# EAGLE design 16bit-v0_2 (EAGLE 7.2.0)
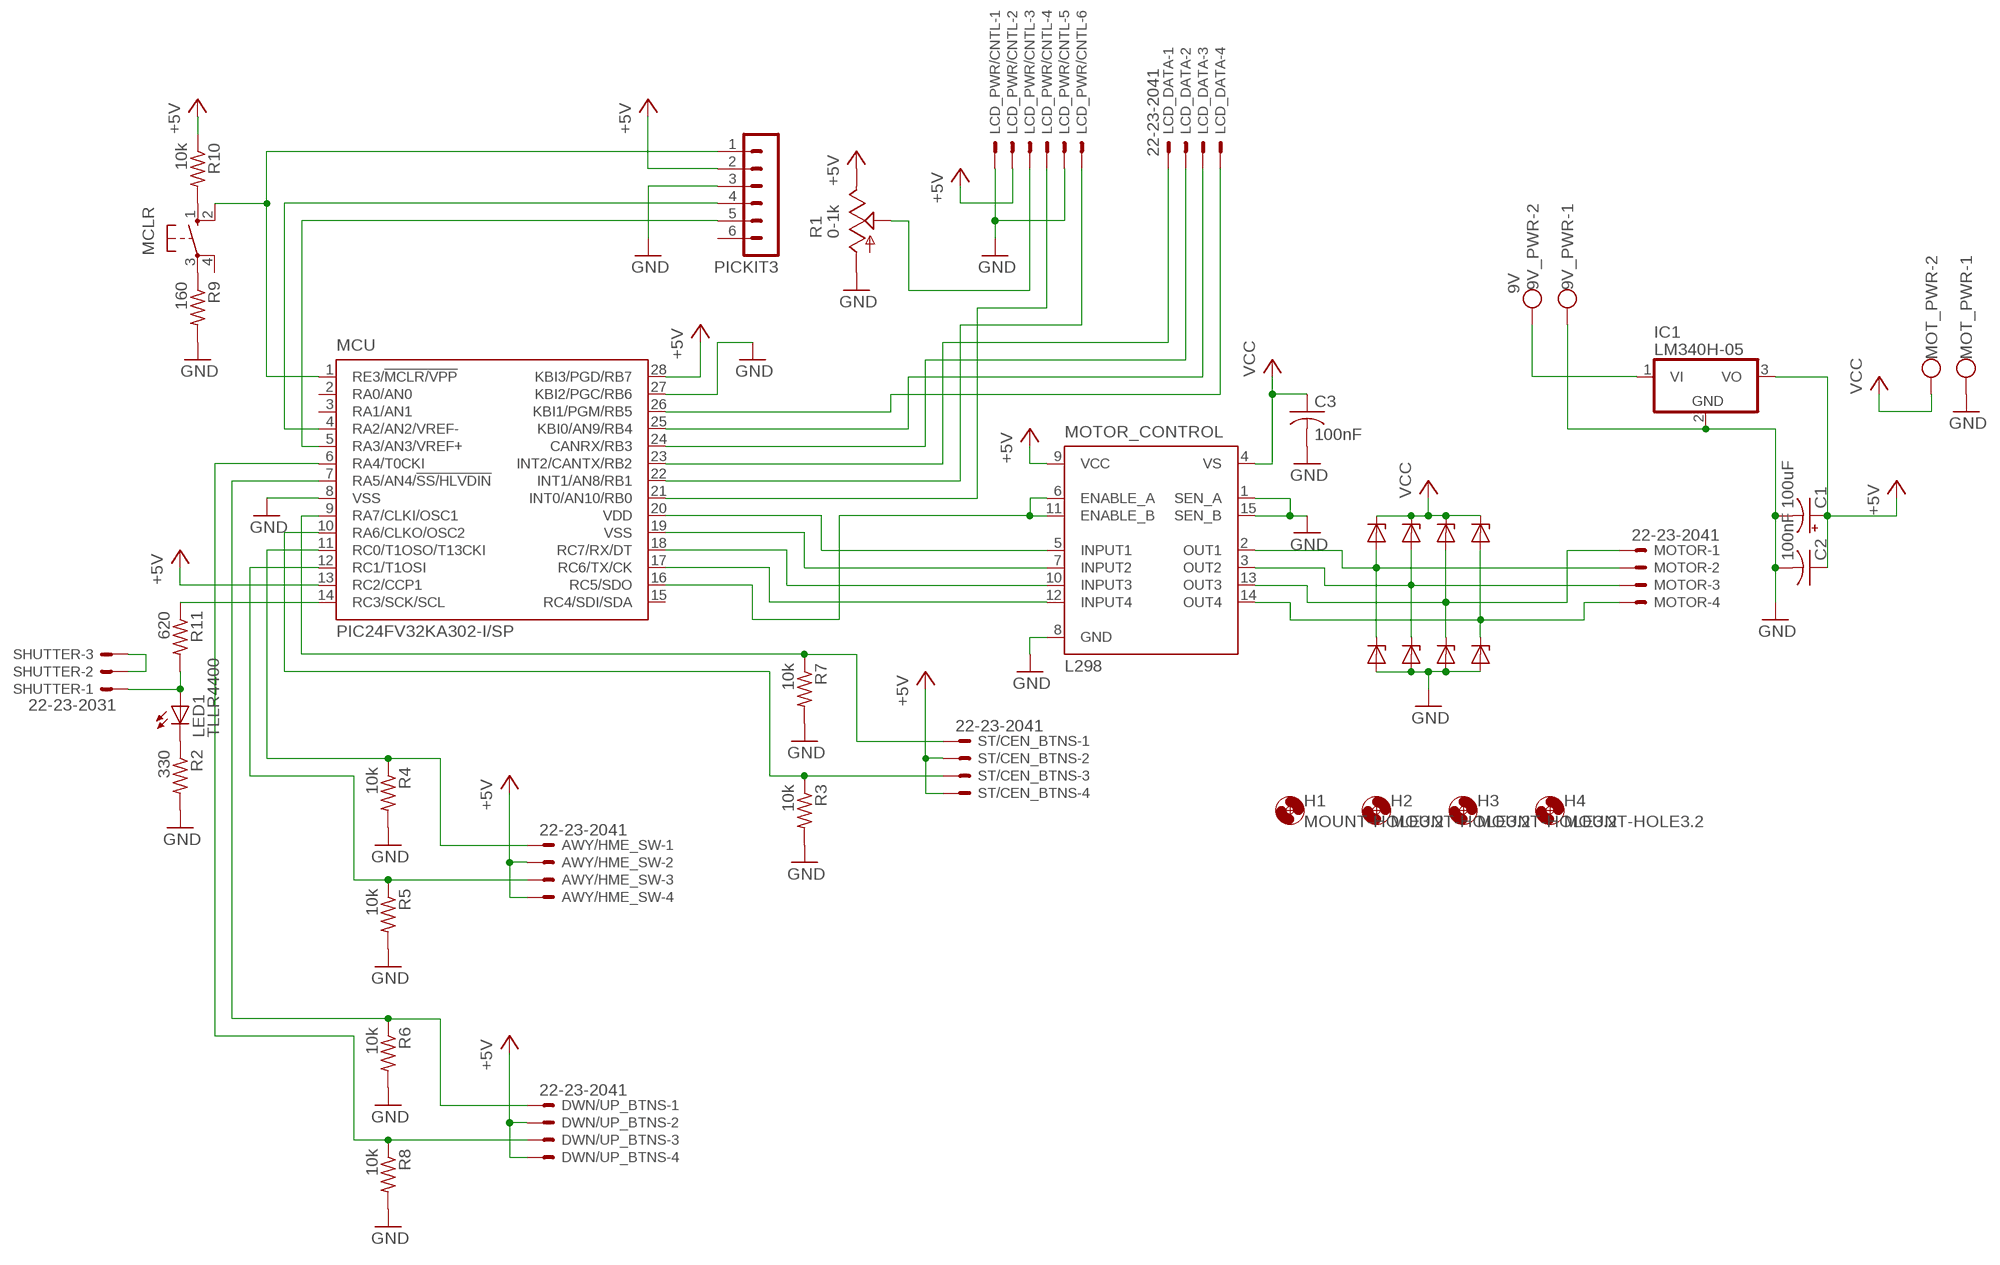
[diagram p0: schematic, sheet 1]

## Parts
9V_PWR  9V  W237-102  [W237-102]
AWY/HME_SW  22-23-2041  [22-23-2041]
C1  100uF  CPOL-USE2.5-7  [E2,5-7]
C2  100nF  C-US025-025X050  [C025-025X050]
C3  100nF  C-US025-025X050  [C025-025X050]
D1  BZX90  [DO34Z7]
D2  BZX90  [DO34Z7]
D3  BZX90  [DO34Z7]
D4  BZX90  [DO34Z7]
D5  BZX90  [DO34Z7]
D6  BZX90  [DO34Z7]
D7  BZX90  [DO34Z7]
D8  BZX90  [DO34Z7]
DWN/UP_BTNS  22-23-2041  [22-23-2041]
H1  MOUNT-HOLE3.2  [3,2]
H2  MOUNT-HOLE3.2  [3,2]
H3  MOUNT-HOLE3.2  [3,2]
H4  MOUNT-HOLE3.2  [3,2]
IC1  LM340H-05  [TO220H]
LCD_DATA  22-23-2041  [22-23-2041]
LCD_PWR/CNTL  22-23-2061  [22-23-2061]
LED1  TLLR4400  [LED3MM]
MCLR  10-XX  [B3F-10XX]
MCU  PIC18F2580-I/SP  [DIL28-3]
MOT_PWR  W237-102  [W237-102]
MOTOR  22-23-2041  [22-23-2041]
MOTOR_CONTROL  L298  [MULTIWATT-15]
PICKIT3  MA06-1  [MA06-1]
R1  0-1k  TRIM_US-B25P  [B25P]
R2  330  R-US_0207/7  [0207/7]
R3  10k  R-US_0207/7  [0207/7]
R4  10k  R-US_0207/7  [0207/7]
R5  10k  R-US_0207/7  [0207/7]
R6  10k  R-US_0207/7  [0207/7]
R7  10k  R-US_0207/7  [0207/7]
R8  10k  R-US_0207/7  [0207/7]
R9  160  R-US_0207/7  [0207/7]
R10  10k  R-US_0207/7  [0207/7]
R11  620  R-US_0207/7  [0207/7]
SHUTTER  22-23-2031  [22-23-2031]
ST/CEN_BTNS  22-23-2041  [22-23-2041]

## Nets
+5V: AWY/HME_SW.2 AWY/HME_SW.4 C1.+ C2.1 DWN/UP_BTNS.2 DWN/UP_BTNS.4 IC1.3(VO) LCD_PWR/CNTL.2 MCU.13(RC2/CCP1) MCU.28(KBI3/PGD/RB7) MOTOR_CONTROL.9(VCC) PICKIT3.2 R1.E R10.1 ST/CEN_BTNS.2 ST/CEN_BTNS.4
GND: 9V_PWR.1 C1.- C2.2 C3.2 D5.A D6.A D7.A D8.A IC1.2(GND) LCD_PWR/CNTL.1 LCD_PWR/CNTL.5 MCU.8(VSS) MCU.27(KBI2/PGC/RB6) MOT_PWR.1 MOTOR_CONTROL.8(GND) PICKIT3.3 R1.A R2.2 R3.2 R4.2 R5.2 R6.2 R7.2 R8.2 R9.2
N$1: MCLR.2(S1) MCU.1(RE3/!MCLR/VPP) PICKIT3.1
N$2: MCU.5(RA3/AN3/VREF+) PICKIT3.5
N$3: MCU.4(RA2/AN2/VREF-) PICKIT3.4
N$4: LED1.K(C) R2.1
N$5: MOTOR_CONTROL.1(SEN_A) MOTOR_CONTROL.15(SEN_B) ; supply symbol labelled GND
N$6: MCU.14(RC3/SCK/SCL) R11.1
N$7: MCU.16(RC5/SDO) MOTOR_CONTROL.6(ENABLE_A) MOTOR_CONTROL.11(ENABLE_B)
N$8: LCD_PWR/CNTL.3 R1.S
N$9: LCD_PWR/CNTL.4 MCU.21(INT0/AN10/RB0)
N$10: LCD_PWR/CNTL.6 MCU.22(INT1/AN8/RB1)
N$11: LCD_DATA.2 MCU.24(CANRX/RB3)
N$12: LCD_DATA.3 MCU.25(KBI0/AN9/RB4)
N$13: LCD_DATA.4 MCU.26(KBI1/PGM/RB5)
N$14: MCU.17(RC6/TX/CK) MOTOR_CONTROL.12(INPUT4)
N$15: AWY/HME_SW.1 MCU.11(RC0/T1OSO/T13CKI) R4.1
N$16: D2.A D6.C MOTOR.3 MOTOR_CONTROL.3(OUT2)
N$17: D3.A D7.C MOTOR.1 MOTOR_CONTROL.13(OUT3)
N$18: D4.A D8.C MOTOR.4 MOTOR_CONTROL.14(OUT4)
N$19: LED1.A R11.2 SHUTTER.1
N$20: LCD_DATA.1 MCU.23(INT2/CANTX/RB2)
N$21: MCU.10(RA6/CLKO/OSC2) R3.1 ST/CEN_BTNS.3
N$22: MCU.18(RC7/RX/DT) MOTOR_CONTROL.10(INPUT3)
N$23: DWN/UP_BTNS.1 MCU.7(RA5/AN4/!SS/HLVDIN) R6.1
N$24: MCU.9(RA7/CLKI/OSC1) R7.1 ST/CEN_BTNS.1
N$25: DWN/UP_BTNS.3 MCU.6(RA4/T0CKI) R8.1
N$26: MCU.19(VSS) MOTOR_CONTROL.7(INPUT2)
N$27: AWY/HME_SW.3 MCU.12(RC1/T1OSI) R5.1
N$28: D1.A D5.C MOTOR.2 MOTOR_CONTROL.2(OUT1)
N$31: MCU.20(VDD) MOTOR_CONTROL.5(INPUT1)
N$35: MCLR.1(S) R10.2
N$36: SHUTTER.2 SHUTTER.3
N$38: MCLR.3(P) R9.1
N$40: 9V_PWR.2 IC1.1(VI)
VCC: C3.1 D1.C D2.C D3.C D4.C MOT_PWR.2 MOTOR_CONTROL.4(VS)
Unconnected: MCLR.4(P1) MCU.2(RA0/AN0) MCU.3(RA1/AN1) MCU.15(RC4/SDI/SDA) PICKIT3.6

## Library data of the parts
9V_PWR MOT_PWR = con-wago-500:W237-102: WAGO SCREW CLAMP; MPN: 237-102; OC_FARNELL: unknown; OC_NEWARK: 70K9898
AWY/HME_SW DWN/UP_BTNS LCD_DATA MOTOR ST/CEN_BTNS = con-molex:22-23-2041: .100" (2.54mm) Center Header - 4 Pin; MF: MOLEX; MPN: 22-23-2041; OC_FARNELL: 1462920; OC_NEWARK: 38C0355
C1 = rcl:CPOL-US: POLARIZED CAPACITOR, American symbol
C2 C3 = rcl:C-US: CAPACITOR, American symbol
D1-D8 = diode:BZX90: Z DIODE
H1-H4 = holes:MOUNT-HOLE: MOUNTING HOLE with drill center marker
IC1 = linear:LM340?-*: Positive VOLTAGE REGULATOR Source: http://cache.national.com/ds/LM/LM340.pdf
LCD_PWR/CNTL = con-molex:22-23-2061: .100" (2.54mm) Center Header - 6 Pin; MF: MOLEX; MPN: 22-23-2061; OC_FARNELL: 1462922; OC_NEWARK: 27C1933
LED1 = led:TLLR4400: Low Current (2mA) LED 3 mm Tinted Diffused Package color RED Source: Data sheet <http://www.farnell.com/datasheets/391100.pdf>; MF: VISHAY SEMICONDUCTOR; OC_FARNELL: 1612437
MCLR = switch-omron:10-XX: OMRON SWITCH; MPN: B3F-1000; OC_FARNELL: 176432; OC_NEWARK: 36M3542
MCU = microchip:PIC18F2*80: 28-Pin Enhanced Flash Microcontrollers with ECAN(TM) Technology 10-Bit A/D and nanoWatt Technology Source: http://www.microchip.com .. 39637a.pdf; MF: MICROCHIP; MPN: PIC24FV32KA302-I/SP; OC_FARNELL: 9321276; OC_NEWARK: 71J7244
MOTOR_CONTROL = st-microelectronics:L298: DUAL FULL-BRIDGE DRIVER; MPN: L298N; OC_FARNELL: 1589425; OC_NEWARK: 32M1527
PICKIT3 = con-lstb:MA06-1: PIN HEADER; OC_FARNELL: unknown; OC_NEWARK: unknown
R1 = pot:TRIM_US-: POTENTIOMETER
R2-R11 = resistor:R-US_: RESISTOR, American symbol
SHUTTER = con-molex:22-23-2031: .100" (2.54mm) Center Header - 3 Pin; MF: MOLEX; MPN: 22-23-2031; OC_FARNELL: 1462950; OC_NEWARK: 30C0862

## Board
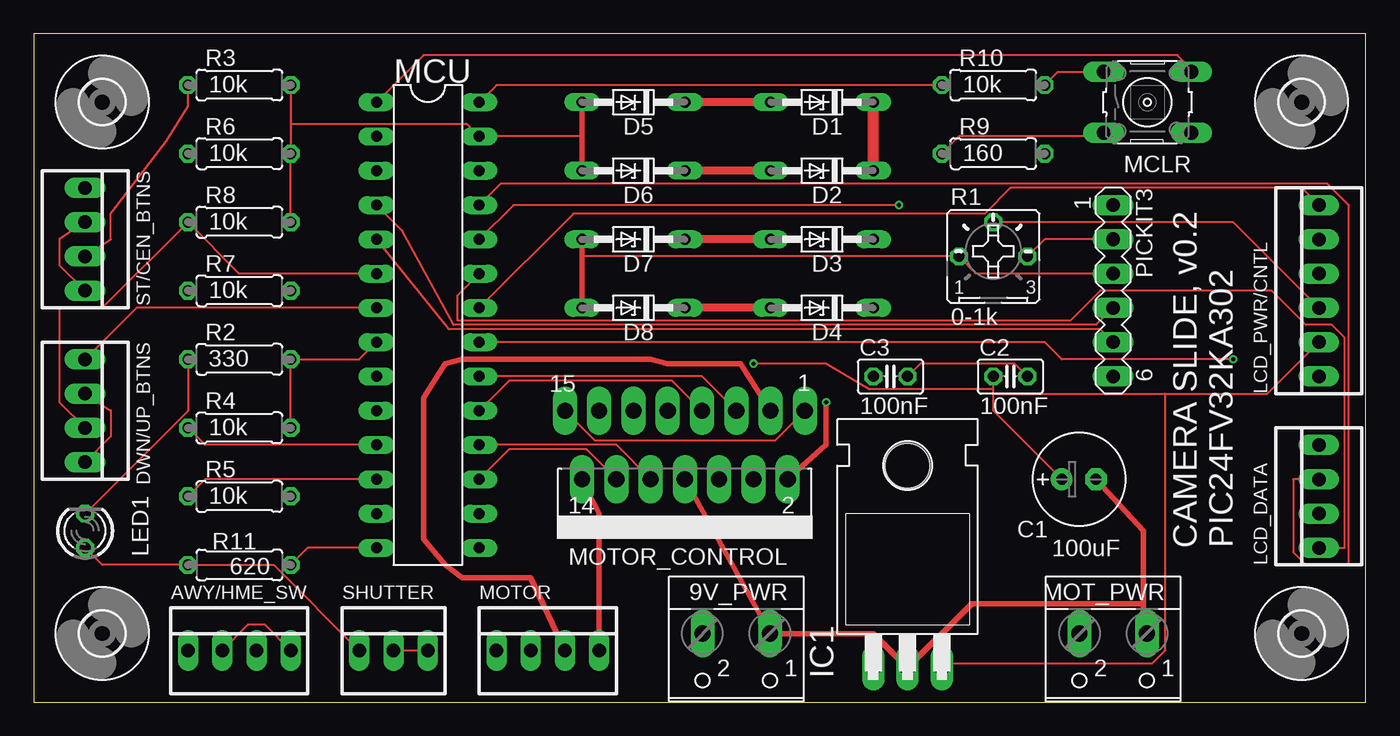
[diagram p1: board, top side]
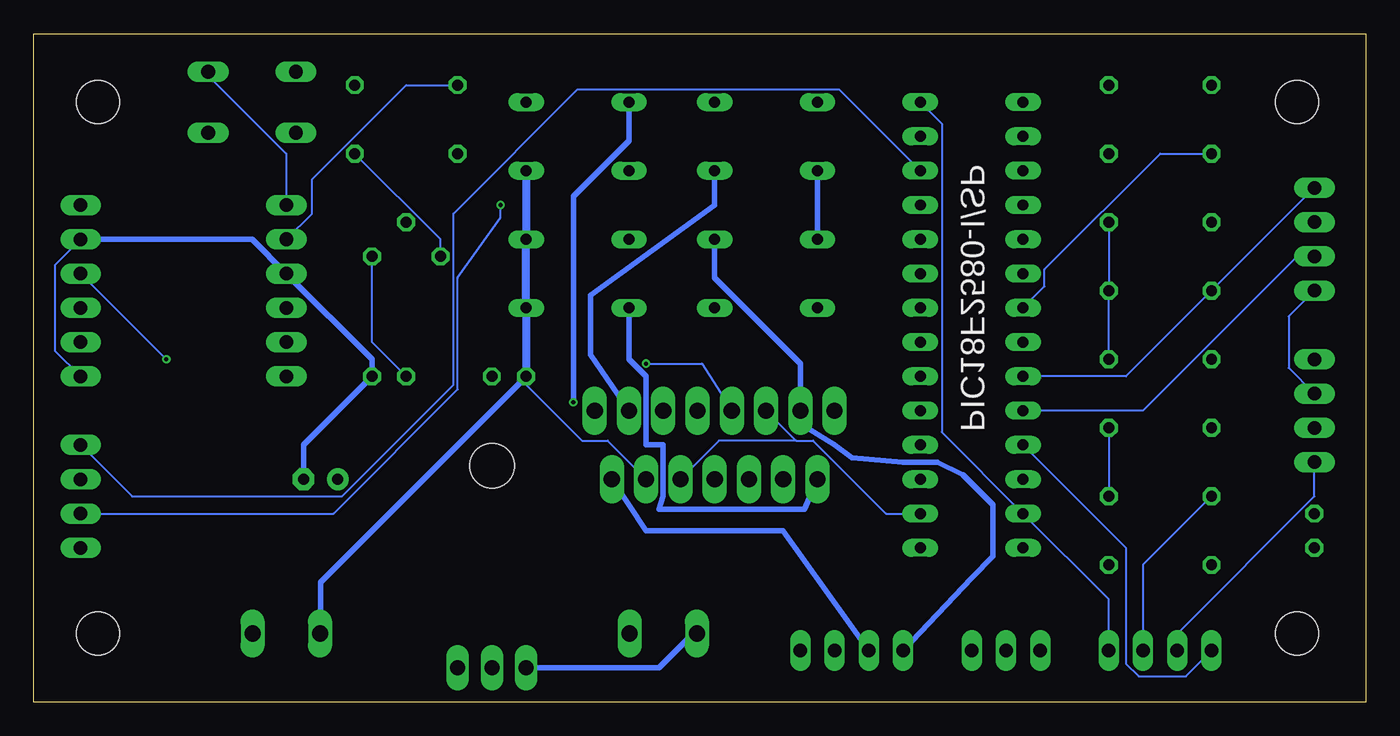
[diagram p2: board, bottom side, seen from below]

Size 98.73 x 49.52 mm. Coordinates in mm from the lower left corner, seen from the top.
Outline: 0,0 98.73,0 98.73,49.52 0,49.52 0,0
Copper layers (1*16): Top 0.035mm / dielectric 1.5mm / Bottom 0.035mm
Design rules "ITEADstudio_DRC": minimum track width 6mil, minimum drill 12mil, track to track 6mil, track to pad 6mil, pad to pad 6mil, via to via 6mil, smd to smd 0mil, copper to edge 10mil, drill to drill 10mil, minimum pad ring 10mil, minimum via ring 6mil, stop-mask expansion 2mil, vias tented up to drill 100mil, thermal gap 10mil

### Footprints (pad centres in the part's own frame; a part is rotated, then mirrored left to right if it is on the bottom)
W237-102 = drill 1.194 long: 1 -2.5,-1.27; 2 2.5,-1.27
22-23-2041 = drill 1 long: 1 -3.81,0; 2 -1.27,0; 3 1.27,0; 4 3.81,0
E2,5-7 = drill 0.813 pad 1.6: + -1.27,0 | drill 0.813 pad 1.6 octagon: - 1.27,0
C025-025X050 = drill 0.813 octagon: 1 -1.27,0; 2 1.27,0
DO34Z7 = drill 0.813 long: A 3.81,0; C -3.81,0
3,2 = hole 3.2: 0,0
TO220H = drill 1.118 long: 1 -2.54,-10.16; 2 0,-10.16; 3 2.54,-10.16 | hole 3.302: 0,4.826
22-23-2061 = drill 1 long: 1 -6.35,0; 2 -3.81,0; 3 -1.27,0; 4 1.27,0; 5 3.81,0; 6 6.35,0
LED3MM = drill 0.813 octagon: A -1.27,0; K 1.27,0
B3F-10XX = drill 1.016 long: 1 -3.251,2.261; 2 3.251,2.261; 3 -3.251,-2.261; 4 3.251,-2.261
DIL28-3 = drill 0.813 long: 1 -16.51,-3.81; 2 -13.97,-3.81; 3 -11.43,-3.81; 4 -8.89,-3.81; 5 -6.35,-3.81; 6 -3.81,-3.81; 7 -1.27,-3.81; 8 1.27,-3.81; 9 3.81,-3.81; 10 6.35,-3.81; 11 8.89,-3.81; 12 11.43,-3.81; 13 13.97,-3.81; 14 16.51,-3.81; 15 16.51,3.81; 16 13.97,3.81; 17 11.43,3.81; 18 8.89,3.81; 19 6.35,3.81; 20 3.81,3.81; 21 1.27,3.81; 22 -1.27,3.81; 23 -3.81,3.81; 24 -6.35,3.81; 25 -8.89,3.81; 26 -11.43,3.81; 27 -13.97,3.81; 28 -16.51,3.81
MULTIWATT-15 = drill 1.2 long: 1 -8.89,-7.62; 2 -7.62,-2.54; 3 -6.35,-7.62; 4 -5.08,-2.54; 5 -3.81,-7.62; 6 -2.54,-2.54; 7 -1.27,-7.62; 8 0,-2.54; 9 1.27,-7.62; 10 2.54,-2.54; 11 3.81,-7.62; 12 5.08,-2.54; 13 6.35,-7.62; 14 7.62,-2.54; 15 8.89,-7.62
MA06-1 = drill 1.016 long: 1 -6.35,0; 2 -3.81,0; 3 -1.27,0; 4 1.27,0; 5 3.81,0; 6 6.35,0
B25P = drill 0.813 octagon: A -2.54,0; E 2.54,0; S 0,2.54
0207/7 = drill 0.813 octagon: 1 -3.81,0; 2 3.81,0
22-23-2031 = drill 1 long: 1 -2.54,0; 2 0,0; 3 2.54,0

### Placement (x,y rotation side)
9V_PWR  52.07,3.81 180 top
AWY/HME_SW  15.24,3.81 0 top
C1  77.47,16.51 0 top
C2  72.39,24.13 0 top
C3  63.5,24.13 0 top
D1  58.42,44.45 180 top
D2  58.42,39.37 180 top
D3  58.42,34.29 180 top
D4  58.42,29.21 180 top
D5  44.45,44.45 180 top
D6  44.45,39.37 180 top
D7  44.45,34.29 180 top
D8  44.45,29.21 180 top
DWN/UP_BTNS  3.81,21.59 270 top
H1  5.08,5.08 0 top
H2  5.08,44.45 0 top
H3  93.98,44.45 0 top
H4  93.98,5.08 0 top
IC1  64.77,12.7 0 top
LCD_DATA  95.25,15.24 90 top
LCD_PWR/CNTL  95.25,30.48 90 top
LED1  3.81,12.7 90 top
MCLR  82.55,44.45 0 top
MCU  29.21,27.94 270 top
MOT_PWR  80.01,3.81 180 top
MOTOR  38.1,3.81 0 top
MOTOR_CONTROL  48.26,13.97 180 top
PICKIT3  80.01,30.48 270 top
R1  71.12,33.02 0 top
R2  15.24,25.4 0 top
R3  15.24,45.72 0 top
R4  15.24,20.32 0 top
R5  15.24,15.24 0 top
R6  15.24,40.64 0 top
R7  15.24,30.48 0 top
R8  15.24,35.56 0 top
R9  71.12,40.64 0 top
R10  71.12,45.72 0 top
R11  15.24,10.16 180 top
SHUTTER  26.67,3.81 0 top
ST/CEN_BTNS  3.81,34.29 270 top

### Tracks (layer width: path | path; a pad name or v marks a point on that pad's centre or on a via)
+5V  (via drill 0.3)
  Top 0.152: DWN/UP_BTNS.4 5.71,19.68 5.71,21.59 DWN/UP_BTNS.2 | ST/CEN_BTNS.4 1.91,32.38 1.91,34.29 ST/CEN_BTNS.2 | AWY/HME_SW.2 15.88,5.71 17.14,5.71 AWY/HME_SW.4 | MCU.28 34.29,45.72 R10.1 | R1.E 74.93,34.29 PICKIT3.2 | 71.12,22.86 71.12,21.59 C1.+ | 71.12,22.86 71.12,23.18 | 71.12,23.18 C2.1 | LCD_PWR/CNTL.2 91.44,22.86 83.82,22.86 | 71.12,22.86 83.82,22.86 | IC1.3 67.63,2.86 82.87,2.86 83.82,3.81 83.82,22.86 | v53.34,25.08 58.74,25.08 61.91,23.18 71.12,23.18
  Bottom 0.152: DWN/UP_BTNS.2 5.71,24.77 5.71,28.57 ST/CEN_BTNS.4 | AWY/HME_SW.4 19.05,7.62 MCU.13 31.43,20 31.43,42.86 MCU.28 | DWN/UP_BTNS.4 3.81,15.24 13.97,5.08 AWY/HME_SW.2 | MOTOR_CONTROL.9 49.21,25.08 v53.34,25.08 | R1.E 73.66,26.67 C2.1 | R10.1 71.12,45.72 78.11,38.73 78.11,36.2 PICKIT3.2
GND
  Top 0.152: 40.64,41.91 MCU.27 32.07,42.86 19.05,42.86 | R3.2 19.05,42.86 | 19.05,42.86 R6.2 R8.2 | R4.2 R2.2 24.13,25.4 MCU.8 | PICKIT3.3 69.85,31.75 R1.A 40.64,33.02 | 9V_PWR.1 54.61,5.08 | C3.2 65.72,25.08 72.71,25.08 C2.2 | 82.23,5.08 MOT_PWR.1
  Top 0.406: D7.A 40.64,33.02 D8.A | D5.A 40.64,41.91 D6.A | MOTOR_CONTROL.8 54.61,5.08 62.23,5.08 IC1.2 69.53,7.3 82.23,7.3 | 82.23,7.3 82.23,12.7 C1.- | 82.23,7.3 82.23,5.08
  Bottom 0.152: R8.2 R7.2 R2.2 | R4.2 R5.2 | LCD_PWR/CNTL.1 97.16,26.04 97.16,32.38 LCD_PWR/CNTL.5 | R9.2 68.58,34.29 R1.A
  Bottom 0.406: D6.A D7.A | LCD_PWR/CNTL.5 82.55,34.29 PICKIT3.3 73.66,25.4 C2.2 78.74,19.05 C1.-
N$1
  Top 0.152: MCU.1 28.89,47.94 84.77,47.94 85.72,46.99 MCLR.2
  Bottom 0.152: PICKIT3.1 80.01,40.64 86.04,46.67 MCLR.2
N$2
  Top 0.152: MCU.5 30.8,27.62 79.06,27.62 PICKIT3.5
N$3
  Top 0.152: MCU.4 27.3,34.92 31.11,27.94 78.74,27.94 PICKIT3.4
N$4
  Top 0.152: LED1.K 11.43,21.59 R2.1
N$5
  Top 0.152: MOTOR_CONTROL.15 41.59,19.37 54.93,19.37 MOTOR_CONTROL.1
N$6
  Top 0.152: R11.1 20.32,11.43 MCU.14
N$7
  Bottom 0.152: MCU.16 35.56,13.97 40.96,19.37 42.23,19.37 | MOTOR_CONTROL.11 42.23,19.37 | MOTOR_CONTROL.6 47.94,19.37 42.23,19.37
N$8
  Top 0.152: R1.S 88.9,35.56 LCD_PWR/CNTL.3
N$9  (via drill 0.3)
  Top 0.152: MCU.21 74.93,26.67 76.2,25.4 v88.9,25.4
  Bottom 0.152: LCD_PWR/CNTL.4 v88.9,25.4
N$10
  Top 0.152: MCU.22 40.01,36.2 70.48,36.2 72.39,38.1 93.98,38.1 LCD_PWR/CNTL.6
N$11  (via drill 0.3)
  Top 0.152: MCU.24 35.56,36.83 v64.14,36.83
  Bottom 0.152: v64.14,36.83 64.14,35.88 67.31,31.43 67.31,23.18 76.52,13.97 LCD_DATA.2
N$12
  Top 0.152: MCU.25 34.61,38.42 95.89,38.42 97.47,36.83 97.47,10.16 94.3,10.16 93.34,11.11 93.34,16.51 LCD_DATA.3
N$13
  Bottom 0.152: MCU.26 39.05,45.4 58.42,45.4 67.63,36.2 67.63,23.5 75.88,15.24 91.44,15.24 LCD_DATA.4
N$14
  Top 0.152: MCU.17 35.24,18.73 40.96,18.73 MOTOR_CONTROL.12
N$15
  Top 0.152: R4.1 12.7,19.05 MCU.11
  Bottom 0.152: AWY/HME_SW.1 13.34,1.91 16.83,1.91 17.78,2.86 17.78,11.43 MCU.11
N$16
  Top 0.406: MOTOR.3 36.83,9.21 31.75,9.21 30.48,10.16 28.89,12.06 28.89,22.54 30.48,25.08 31.75,25.4 45.72,25.4 46.99,25.08 52.39,25.08 MOTOR_CONTROL.3
  Top 0.61: D2.A D6.C
  Bottom 0.406: D6.C 48.26,36.83 57.47,30.16 57.47,25.72 MOTOR_CONTROL.3
N$17
  Top 0.61: D3.A D7.C
  Bottom 0.406: MOTOR.1 29.21,9.21 27.62,10.79 27.62,14.61 29.84,16.83 31.75,17.78 34.29,17.78 38.1,18.1 39.37,19.05 41.91,20.64 42.23,21.27 MOTOR_CONTROL.13 41.91,25.08 48.26,31.43 D7.C
N$18
  Top 0.406: MOTOR.4 41.91,13.97 MOTOR_CONTROL.14
  Top 0.61: D4.A D8.C
  Bottom 0.406: D4.A 54.61,25.4 53.34,24.13 53.34,19.05 52.07,19.05 52.07,15.24 52.39,14.29 41.59,14.29 MOTOR_CONTROL.14
N$19
  Top 0.152: LED1.A 5.08,10.16 R11.2 17.78,10.16 SHUTTER.1
N$20
  Top 0.152: MCU.23 31.43,30.16 31.43,28.26 76.83,28.26 79.06,30.48 91.76,30.48 94.3,27.94 96.2,27.94 97.16,26.99 97.16,11.43 LCD_DATA.1
N$21
  Top 0.152: R3.1 11.43,44.13 9.84,41.59 5.71,36.2 5.71,34.29 ST/CEN_BTNS.3
  Bottom 0.152: MCU.10 16.51,21.59 5.08,33.02 ST/CEN_BTNS.3
N$22
  Top 0.152: MCU.18 43.18,19.05 MOTOR_CONTROL.10
N$23
  Top 0.152: DWN/UP_BTNS.1 7.62,29.21 MCU.7
  Bottom 0.152: R6.1 15.24,40.64 23.81,32.07 23.81,30.8 MCU.7
N$24
  Bottom 0.152: ST/CEN_BTNS.1 R7.1 17.78,24.13 MCU.9
N$25
  Top 0.152: MCU.6 15.24,31.75 R8.1 5.08,29.21 1.91,29.21 1.91,22.23 DWN/UP_BTNS.3
N$26
  Top 0.152: MCU.19 35.24,23.81 47.31,23.81 MOTOR_CONTROL.7
N$27
  Top 0.152: R5.1 12.7,16.51 MCU.12
  Bottom 0.152: AWY/HME_SW.3 16.51,10.16 R5.1
N$28  (via drill 0.3)
  Top 0.406: v58.74,22.23 58.74,19.05 MOTOR_CONTROL.2
  Top 0.61: D1.A D5.C
  Bottom 0.406: MOTOR.2 43.18,12.7 53.34,12.7 MOTOR_CONTROL.2 | D1.A 54.61,41.59 58.74,37.47 v58.74,22.23
N$31
  Top 0.152: MCU.20 49.53,24.13 MOTOR_CONTROL.5
N$35
  Top 0.152: R10.2 75.88,46.67 79.06,46.67 MCLR.1
N$36
  Top 0.152: SHUTTER.3 SHUTTER.2
N$38
  Top 0.152: R9.1 68.58,41.91 79.06,41.91 MCLR.3
N$40
  Bottom 0.152: 49.85,5.08 9V_PWR.2
  Bottom 0.406: IC1.1 52.39,2.54 49.85,5.08
VCC
  Top 0.813: D2.C D1.C
  Bottom 0.152: 77.47,5.08 MOT_PWR.2 | MOTOR_CONTROL.4 56.2,19.37 58.1,19.37 62.55,23.81 C3.1
  Bottom 0.406: 77.47,5.08 77.47,8.89 62.55,23.81
  Bottom 0.61: D2.C D3.C D4.C C3.1

### Text on the board
tPlace: CAMERA SLIDE, v0.2 / PIC24FV32KA302